# EasyEDA schematic control_board_schematic.json
TITLE: Sheet_1; REV: 1.0; Date: 2021-07-24; Sheet: 1/1; Drawn By: Gustavo Moraes; Company: Your Company
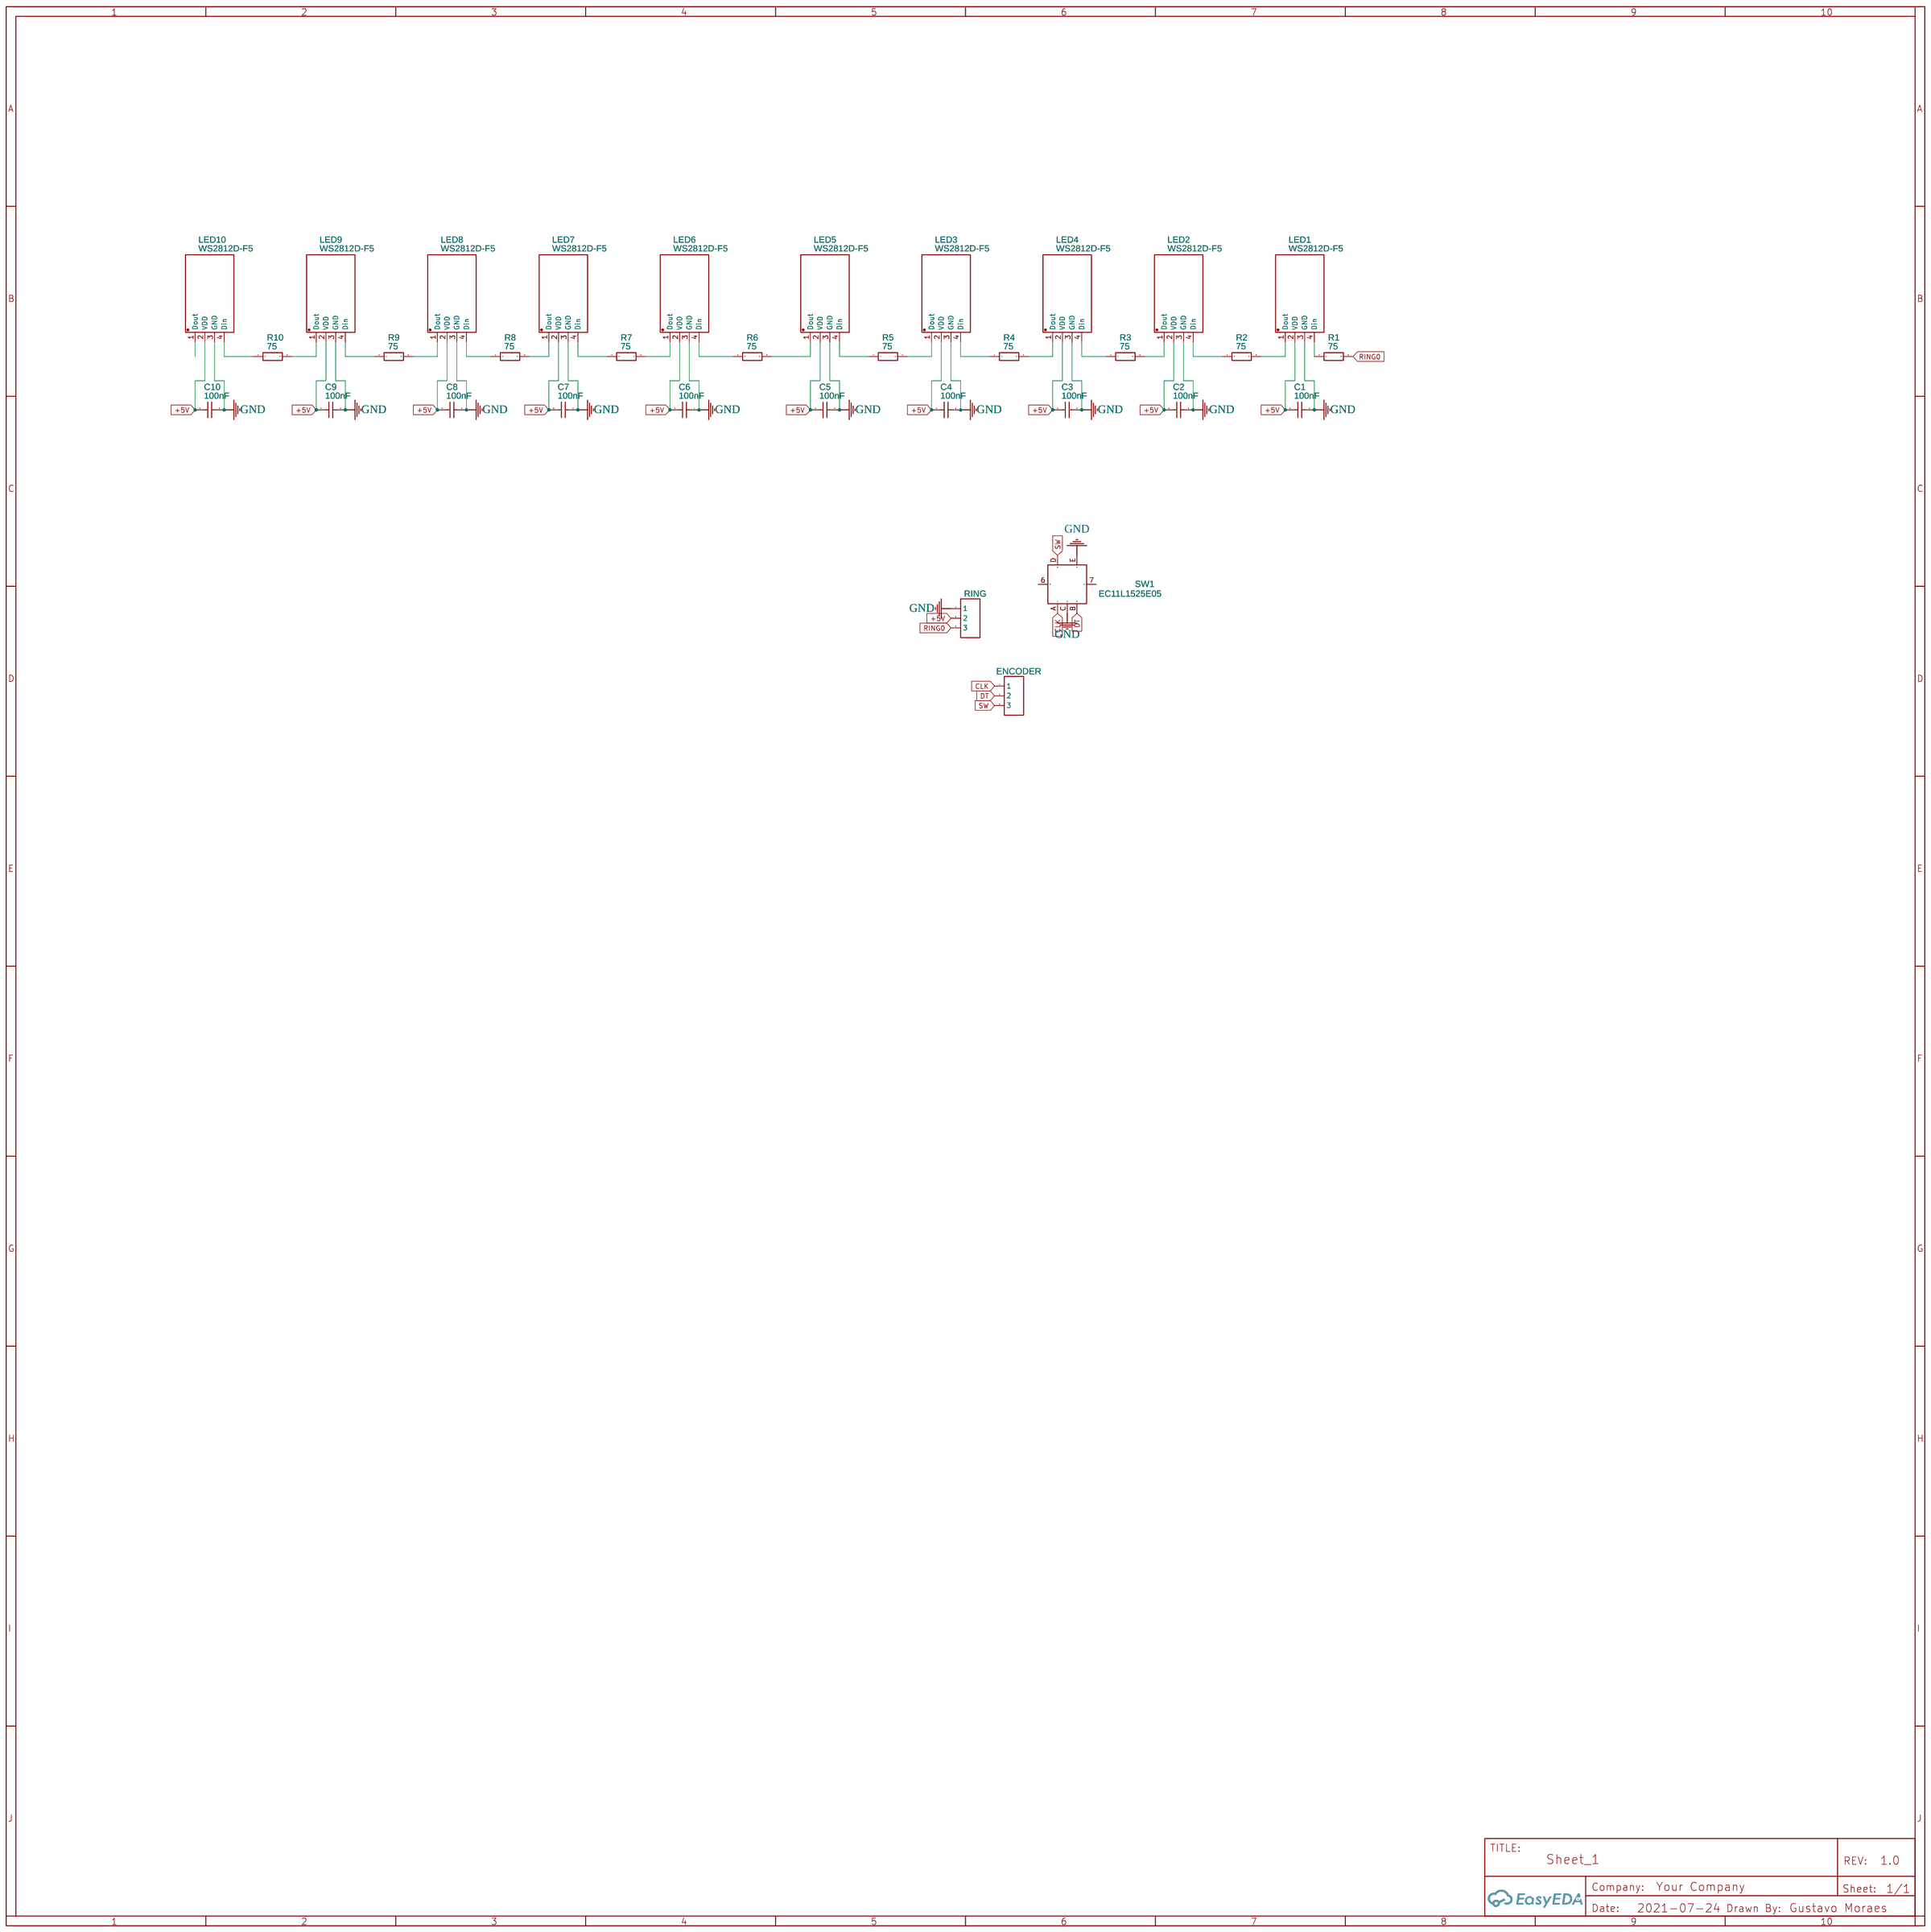
[diagram p0: schematic sheet]

## Parts
C1  100nF  [C0603]
C2  100nF  [C0603]
C3  100nF  [C0603]
C4  100nF  [C0603]
C5  100nF  [C0603]
C6  100nF  [C0603]
C7  100nF  [C0603]
C8  100nF  [C0603]
C9  100nF  [C0603]
C10  100nF  [C0603]
ENCODER  HDR-M-2.54_1x3  [HDR-M-2.54_1X3]
LED1  WS2812D-F5  [LED-TH_4P-BD5.8-P1.30]
LED2  WS2812D-F5  [LED-TH_4P-BD5.8-P1.30]
LED3  WS2812D-F5  [LED-TH_4P-BD5.8-P1.30]
LED4  WS2812D-F5  [LED-TH_4P-BD5.8-P1.30]
LED5  WS2812D-F5  [LED-TH_4P-BD5.8-P1.30]
LED6  WS2812D-F5  [LED-TH_4P-BD5.8-P1.30]
LED7  WS2812D-F5  [LED-TH_4P-BD5.8-P1.30]
LED8  WS2812D-F5  [LED-TH_4P-BD5.8-P1.30]
LED9  WS2812D-F5  [LED-TH_4P-BD5.8-P1.30]
LED10  WS2812D-F5  [LED-TH_4P-BD5.8-P1.30]
R1  75  [R0805]
R2  75  [R0805]
R3  75  [R0805]
R4  75  [R0805]
R5  75  [R0805]
R6  75  [R0805]
R7  75  [R0805]
R8  75  [R0805]
R9  75  [R0805]
R10  75  [R0805]
RING  HDR-M-2.54_1x3  [HDR-M-2.54_1X3]
SW1  EC11L1525E05  [SW-TH_EC11L1525E05]

## Library data of the parts
C1-C10 = 0603B104K160: Supplier: LCSC; Manufacturer: WTC; Supplier Part: C80516; JLCPCB Part Class: Extended Part
ENCODER RING = HDR-M-2.54_1x3: Supplier Part: C180248; Supplier: LCSC; Contributor: LCEDA_Lib
LED1-LED10 = WS2812D-F5: Supplier: LCSC; Supplier Part: C190565; Manufacturer: Worldsemi; Contributor: LCSC; JLCPCB Part Class: Extended Part
R1-R10 = RC0805JR-0775RL: Supplier: LCSC; Manufacturer: YAGEO; Supplier Part: C113304; JLCPCB Part Class: Extended Part; Resistance: 75Ω
SW1 = EC11L1525E05: Supplier: LCSC; Supplier Part: C2687298; Manufacturer: ALPSALPINE(阿尔卑斯阿尔派); Contributor: LCSC; JLCPCB Part Class: Extended Part

## Nets
+5V: C1.2 C2.2 C3.2 C4.2 C5.2 C6.2 C7.2 C8.2 C9.2 C10.2 LED1.2(VDD) LED2.2(VDD) LED3.2(VDD) LED4.2(VDD) LED5.2(VDD) LED6.2(VDD) LED7.2(VDD) LED8.2(VDD) LED9.2(VDD) LED10.2(VDD) RING.2
GND: C1.1 C2.1 C3.1 C4.1 C5.1 C6.1 C7.1 C8.1 C9.1 C10.1 LED1.3(GND) LED2.3(GND) LED3.3(GND) LED4.3(GND) LED5.3(GND) LED6.3(GND) LED7.3(GND) LED8.3(GND) LED9.3(GND) LED10.3(GND) RING.1 SW1.C SW1.E
CLK: ENCODER.1 SW1.A
DT: ENCODER.2 SW1.B
RING0: R1.2 RING.3
SW: ENCODER.3 SW1.D
Net-(LED1-1): LED1.1(Dout) R2.2
Net-(LED1-4): LED1.4(Din) R1.1
Net-(LED2-1): LED2.1(Dout) R3.2
Net-(LED2-4): LED2.4(Din) R2.1
Net-(LED3-1): LED3.1(Dout) R5.2
Net-(LED3-4): LED3.4(Din) R4.1
Net-(LED4-1): LED4.1(Dout) R4.2
Net-(LED4-4): LED4.4(Din) R3.1
Net-(LED5-1): LED5.1(Dout) R6.2
Net-(LED5-4): LED5.4(Din) R5.1
Net-(LED6-1): LED6.1(Dout) R7.2
Net-(LED6-4): LED6.4(Din) R6.1
Net-(LED7-1): LED7.1(Dout) R8.2
Net-(LED7-4): LED7.4(Din) R7.1
Net-(LED8-1): LED8.1(Dout) R9.2
Net-(LED8-4): LED8.4(Din) R8.1
Net-(LED9-1): LED9.1(Dout) R10.2
Net-(LED9-4): LED9.4(Din) R9.1
Net-(LED10-4): LED10.4(Din) R10.1

Not connected (* = marked no-connect by the designer): LED10 1(Dout); SW1 6(EH) 7(EH)
